# Altium schematic sheet MCU.SchDoc: MoonPilot - MCU
size A3; DrawnBy: Máni Magnússon; Revision: A
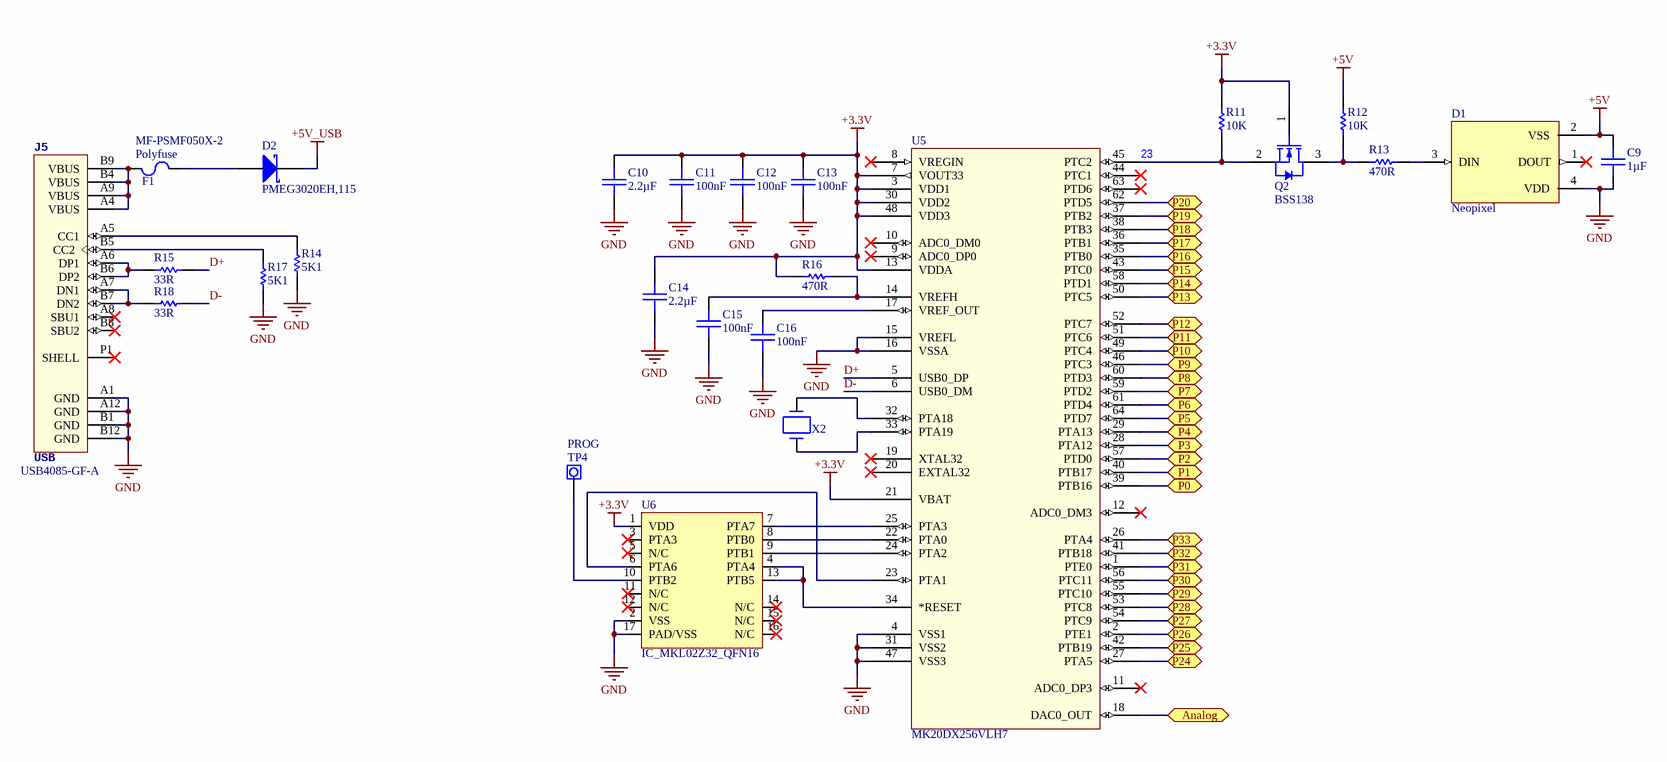
[diagram p0: MCU.SchDoc]

## Parts
C9  1µF  [0603_CAP]
C10  2.2µF  [0603_CAP]
C11  100nF  [0603_CAP]
C12  100nF  [0603_CAP]
C13  100nF  [0603_CAP]
C14  2.2µF  [0603_CAP]
C15  100nF  [0603_CAP]
C16  100nF  [0603_CAP]
D1  Neopixel  [2659]
D2  PMEG3020EH,115  [SOD-123]
F1  Polyfuse  [0805]
J5  USB  [GCT_USB4085-GF-A_REVA]
Q2  BSS138  [INTR-SOT-23-3_V]
R11  10K  [0603_RES]
R12  10K  [0603_RES]
R13  470R  [0603_RES]
R14  5K1  [0603_RES]
R15  33R  [0603_RES]
R16  470R  [0603_RES]
R17  5K1  [0603_RES]
R18  33R  [0603_RES]
TP4  PROG  [Testpoint2]
U5  MK20DX256VLH7  [98ASS23234W_NXP]
U6  IC_MKL02Z32_QFN16  [QFN50P300X300X65-17N]
X2  NX3225SA-16.000000MHZ-B3  [XTAL_NX3225SA]  (value not drawn)

## Ports
Analog (bidir), P0 (bidir), P1 (bidir), P2 (bidir), P3 (bidir), P4 (bidir), P5 (bidir), P6 (bidir), P7 (bidir), P8 (bidir), P9 (bidir), P10 (bidir), P11 (bidir), P12 (bidir), P13 (bidir), P14 (bidir), P15 (bidir), P16 (bidir), P17 (bidir), P18 (bidir), P19 (bidir), P20 (bidir), P24 (bidir), P25 (bidir), P26 (bidir), P27 (bidir), P28 (bidir), P29 (bidir), P30 (bidir), P31 (bidir), P32 (bidir), P33 (bidir)

## Nets
+3.3V: C10.1 C11.1 C12.1 C13.1 C14.1 Q2.1(G) R11.1 R16.1 U5.3(VDD1) U5.7(VOUT33) U5.13(VDDA) U5.21(VBAT) U5.30(VDD2) U5.48(VDD3) U6.1(VDD)
+5V: C9.1 D1.2(VSS) R12.1
+5V_USB: D2.2(K)
GND: C9.2 C10.2 C11.2 C12.2 C13.2 C14.2 C15.2 C16.2 D1.4(VDD) J5.A1(GND) J5.A12(GND) J5.B1(GND) J5.B12(GND) R14.2 R17.1 U5.4(VSS1) U5.15(VREFL) U5.16(VSSA) U5.31(VSS2) U5.47(VSS3) U6.2(VSS) U6.17(PAD/VSS)
Analog: U5.18(DAC0_OUT) ; port Analog
D+: R15.2 U5.5(USB0_DP)
D-: R18.2 U5.6(USB0_DM)
P0: U5.39(PTB16) ; port P0
P1: U5.40(PTB17) ; port P1
P2: U5.57(PTD0) ; port P2
P3: U5.28(PTA12) ; port P3
P4: U5.29(PTA13) ; port P4
P5: U5.64(PTD7) ; port P5
P6: U5.61(PTD4) ; port P6
P7: U5.59(PTD2) ; port P7
P8: U5.60(PTD3) ; port P8
P9: U5.46(PTC3) ; port P9
P10: U5.49(PTC4) ; port P10
P11: U5.51(PTC6) ; port P11
P12: U5.52(PTC7) ; port P12
P13: U5.50(PTC5) ; port P13
P14: U5.58(PTD1) ; port P14
P15: U5.43(PTC0) ; port P15
P16: U5.35(PTB0) ; port P16
P17: U5.36(PTB1) ; port P17
P18: U5.38(PTB3) ; port P18
P19: U5.37(PTB2) ; port P19
P20: U5.62(PTD5) ; port P20
P24: U5.27(PTA5) ; port P24
P25: U5.42(PTB19) ; port P25
P26: U5.2(PTE1) ; port P26
P27: U5.54(PTC9) ; port P27
P28: U5.53(PTC8) ; port P28
P29: U5.55(PTC10) ; port P29
P30: U5.56(PTC11) ; port P30
P31: U5.1(PTE0) ; port P31
P32: U5.41(PTB18) ; port P32
P33: U5.26(PTA4) ; port P33
NetC15_1: C15.1 R16.2 U5.14(VREFH)
NetC16_1: C16.1 U5.17(VREF_OUT)
NetD1_3: D1.3(DIN) R13.2
NetD2_1: D2.1(A) F1.2
NetF1_1: F1.1 J5.A4(VBUS) J5.A9(VBUS) J5.B4(VBUS) J5.B9(VBUS)
NetJ5_A5: J5.A5(CC1) R14.1
NetJ5_A6: J5.A6(DP1) J5.B6(DP2) R15.1
NetJ5_A7: J5.A7(DN1) J5.B7(DN2) R18.1
NetJ5_B5: J5.B5(CC2) R17.2
NetQ2_2: Q2.2(S) R11.2 U5.45(PTC2)
NetQ2_3: Q2.3(D) R12.2 R13.1
NetTP4_1: TP4.1 U6.10(PTB2)
NetU5_22: U5.22(PTA0) U6.8(PTB0)
NetU5_23: U5.23(PTA1) U6.6(PTA6)
NetU5_24: U5.24(PTA2) U6.9(PTB1)
NetU5_25: U5.25(PTA3) U6.7(PTA7)
NetU5_32: U5.32(PTA18) X2.3
NetU5_33: U5.33(PTA19) X2.1
NetU5_34: U5.34(*RESET) U6.4(PTA4) U6.13(PTB5)

Not connected (* = marked no-connect by the designer): D1 1(DOUT)*; J5 A8(SBU1)* B8(SBU2)* P1(SHELL)*; U5 8(VREGIN)* 9(ADC0_DP0)* 10(ADC0_DM0)* 11(ADC0_DP3)* 12(ADC0_DM3)* 19(XTAL32)* 20(EXTAL32)* 44(PTC1)* 63(PTD6)*; U6 3(PTA3)* 5(N/C)* 11(N/C)* 12(N/C)* 14(N/C)* 15(N/C)* 16(N/C)*

## Notes on the sheet
- (near F1) MF-PSMF050X-2
- (near U5) 23
- (near J5) USB4085-GF-A
- Sheet title:
- Revision:
- Drawn by:
- Date:
- File:

## Library data of the parts
C9-C16 = Capacitor
D1 = Neopixel: Adafruit Neopixel SMD 3535 / Adafruit part no. 2659 / Digikey part no. 1528-1542-ND; MF: Adafruit Industries; MP: 2659; SnapEDA_Link: https://www.snapeda.com/parts/2659/Adafruit%20Industries%20LLC/view-part/548522/?ref=snap; Package: TQFP-32 Adafruit Industries; Digi-Key_Purchase_URL: https://www.digikey.com/product-detail/en/pololu-corporation/2659/2183-2659-ND/10451102?utm_source=snapeda&utm_medium=aggregator&utm_campaign=symbol; Digi-Key_Part_Number: 2183-2659-ND; Value: *
D2 = Schottky diode: Digikey part no. 1727-3873-1-ND
F1 = Fuse: MF-PSMF050X-2 / Digikey part no. MF-PSMF050X-2CT-ND
J5 = USB4085-GF-A_revA: USB 2.0 Type C Receptacle Dip Type, PCB Top Mount / (Digikey part no. 2073-USB4085-GF-ACT-ND); MANUFACTURER: Global Connector Technology; PARTREV: A; STANDARD: Manufacturer Recommendations
Q2 = IRLML2502TRPBF: N-MOS transistor / Digikey part no. BSS138CT-ND; Manufacturer: International Rectifier; Drain-to-Source Voltage [Vdss]: 20V; Drain-Source On Resistance-Max: 0.045O; Qg Gate Charge: 8nC; Rated Power Dissipation: 1.25W; Channel Type: N-Channel; Package Reference: SOT-23-3; Manufacturer URL: http://internationalrectifier.com/; Package Description: 3-Pin Small Outline Transistor, Body 2.92 x 1.3 mm, Pitch 0.95 mm; Datasheet Version: Apr-14; Datasheet URL: https://datasheet.ciiva.com/6383/irlml2502pbf-6383216.pdf
R11-R18 = Resistor
TP4 = Testpoint
U5 = MK20DX256VLH7: No Description Available; Vendor: NXP; CPU: ARM Cortex-M4; Max_Frequency: 72; Flash_KB: 256; SRAM_KB: 64; SourceLibrary: NXP_2015-03-30; Manufacturer_Part_Number: MK20DX256VLH7; Pin_Count: 64; Package: LQFP; Copyright: Copyright (C) 2016 Accelerated Designs. All rights reserved; RefDes: RefDes; Type: DEV
U6 = IC_MKL02Z32_QFN16: Teensy bootloader; MP: MKL02Z32VFG4; MF: NXP USA; Availability: Unavailable; Price: None; Value: *; SnapEDA_Link: https://www.snapeda.com/parts/MKL02Z32VFG4/NXP%20USA%20Inc./view-part/492537/?ref=snap; Package: QFN-16 NXP Semiconductors
X2 = XTAL_16 MHz: Digikey part no. 644-1099-1-ND